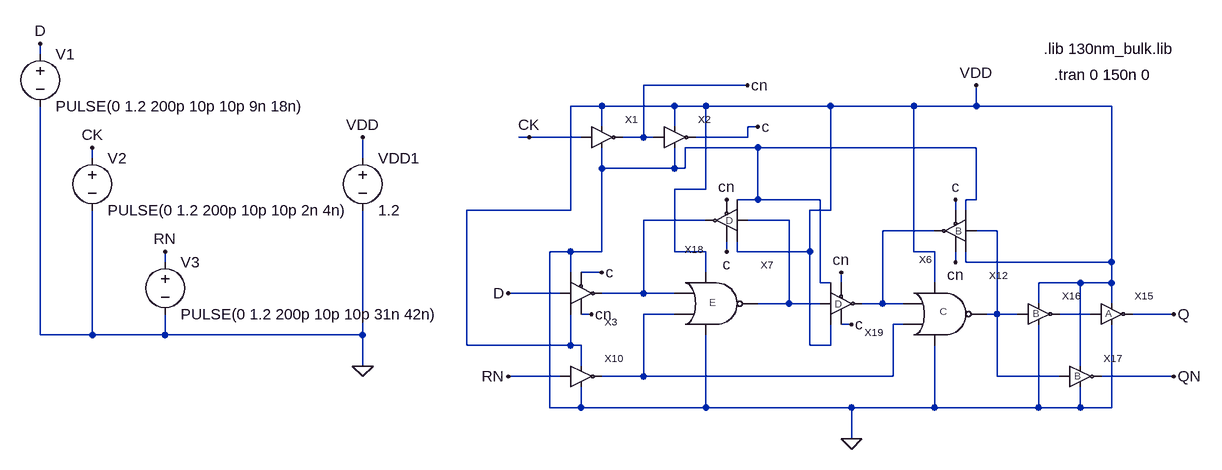
[diagram p0: schematic test2.asc]
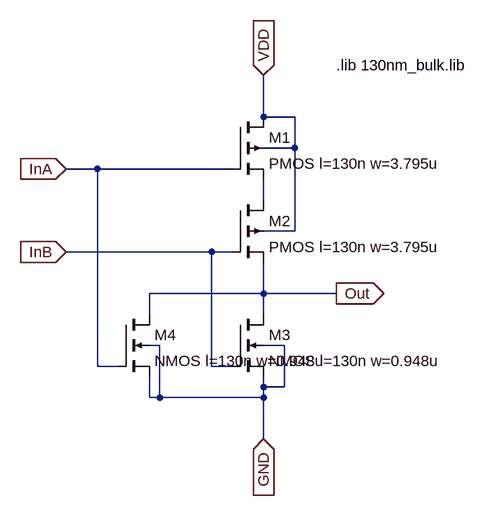
[diagram p1: sub-circuit nor_e.asc]
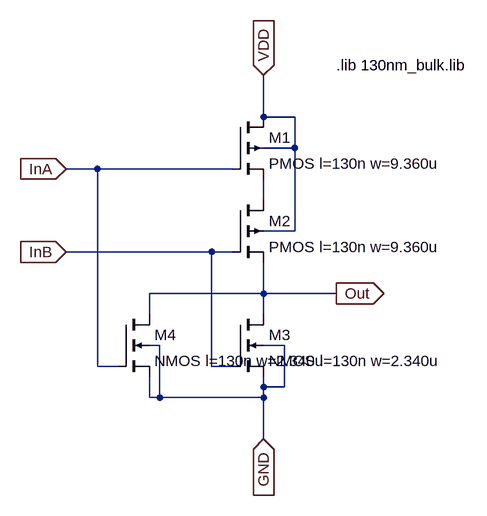
[diagram p2: sub-circuit nor_c.asc]
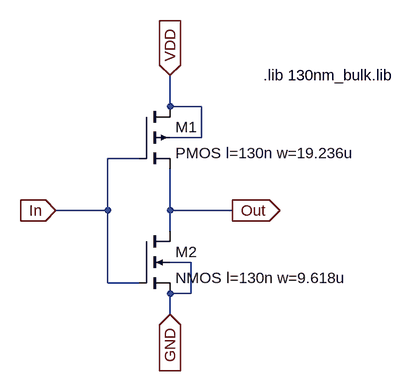
[diagram p3: sub-circuit inverter_a.asc]
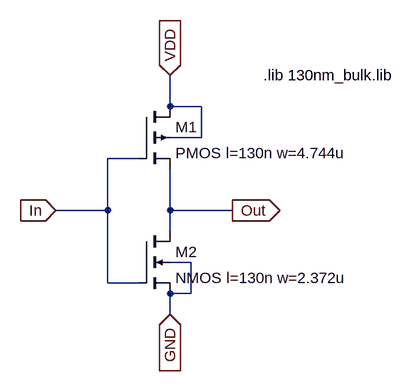
[diagram p4: sub-circuit inverter_b.asc]
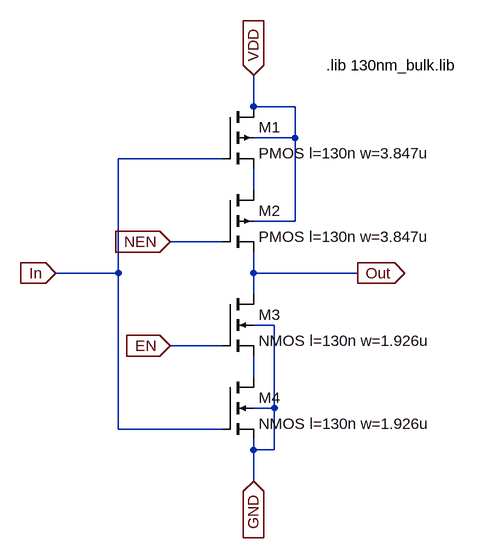
[diagram p5: sub-circuit tristate_inv_d.asc]
test2.asc, the LTspice schematic file:
Version 4
SHEET 1 904 680
WIRE -1008 -144 -1008 -160
WIRE 80 -96 -80 -96
WIRE -144 -64 -192 -64
WIRE -32 -64 -144 -64
WIRE 16 -64 -32 -64
WIRE 208 -64 16 -64
WIRE 336 -64 208 -64
WIRE 432 -64 432 -96
WIRE 432 -64 336 -64
WIRE 640 -64 432 -64
WIRE -144 -32 -144 -64
WIRE -32 -32 -32 -64
WIRE 96 -32 80 -32
WIRE -256 -16 -272 -16
WIRE -176 -16 -256 -16
WIRE -80 -16 -80 -96
WIRE -80 -16 -112 -16
WIRE -64 -16 -80 -16
WIRE 80 -16 80 -32
WIRE 80 -16 0 -16
WIRE 96 0 -16 0
WIRE 432 0 96 0
WIRE -928 16 -928 0
WIRE -512 16 -512 -16
WIRE -144 32 -144 0
WIRE -32 32 -32 0
WIRE -32 32 -144 32
WIRE -16 32 -16 0
WIRE -16 32 -32 32
WIRE 16 64 16 -64
WIRE 16 64 -32 64
WIRE 96 80 96 0
WIRE 96 80 64 80
WIRE 192 80 96 80
WIRE 432 80 432 0
WIRE 432 80 416 80
WIRE -192 96 -192 -64
WIRE -192 96 -352 96
WIRE 208 96 208 -64
WIRE 208 96 176 96
WIRE 400 96 400 80
WIRE 416 96 416 80
WIRE 16 112 -80 112
WIRE 144 112 80 112
WIRE 368 128 288 128
WIRE 464 128 432 128
WIRE -192 160 -224 160
WIRE -144 160 -144 32
WIRE -144 160 -192 160
WIRE -32 160 -32 64
WIRE 16 160 -32 160
WIRE 48 160 48 144
WIRE 64 160 64 144
WIRE 176 160 176 96
WIRE 176 160 64 160
WIRE 336 160 336 -64
WIRE 368 160 336 160
WIRE -816 176 -816 160
WIRE 400 176 400 160
WIRE 416 176 416 160
WIRE 640 176 640 -64
WIRE 640 176 416 176
WIRE -192 192 -192 160
WIRE -144 192 -176 192
WIRE 16 192 16 160
WIRE 192 208 192 80
WIRE 208 208 192 208
WIRE 224 208 224 192
WIRE 368 208 368 160
WIRE 592 208 528 208
WIRE 640 208 640 176
WIRE 640 208 592 208
WIRE -208 224 -288 224
WIRE -80 224 -80 112
WIRE -80 224 -144 224
WIRE -32 224 -80 224
WIRE 144 240 144 112
WIRE 144 240 96 240
WIRE 192 240 144 240
WIRE 288 240 288 128
WIRE 288 240 256 240
WIRE 320 240 288 240
WIRE 528 240 528 208
WIRE 640 240 640 208
WIRE -160 256 -176 256
WIRE -32 256 -80 256
WIRE 464 256 464 128
WIRE 464 256 448 256
WIRE 496 256 464 256
WIRE 608 256 560 256
WIRE 736 256 672 256
WIRE 240 272 224 272
WIRE 320 272 304 272
WIRE -1008 288 -1008 -64
WIRE -928 288 -928 96
WIRE -928 288 -1008 288
WIRE -816 288 -816 256
WIRE -816 288 -928 288
WIRE -512 288 -512 96
WIRE -512 288 -816 288
WIRE -352 304 -352 96
WIRE -192 304 -192 256
WIRE -192 304 -352 304
WIRE -176 304 -192 304
WIRE 176 304 176 160
WIRE 208 304 208 272
WIRE 208 304 176 304
WIRE -512 336 -512 288
WIRE -176 336 -176 304
WIRE 592 336 592 208
WIRE -208 352 -288 352
WIRE -80 352 -80 256
WIRE -80 352 -144 352
WIRE 304 352 304 272
WIRE 304 352 -80 352
WIRE 464 352 464 256
WIRE 560 352 464 352
WIRE 736 352 624 352
WIRE -224 400 -224 160
WIRE -176 400 -176 368
WIRE -176 400 -224 400
WIRE 16 400 16 288
WIRE 16 400 -176 400
WIRE 240 400 16 400
WIRE 368 400 368 304
WIRE 368 400 240 400
WIRE 528 400 528 272
WIRE 528 400 368 400
WIRE 592 400 592 368
WIRE 592 400 528 400
WIRE 640 400 640 272
WIRE 640 400 592 400
WIRE 240 448 240 400
FLAG -512 336 0
FLAG -1008 -160 D
FLAG -928 0 CK
FLAG -816 160 RN
FLAG -288 224 D
FLAG -288 352 RN
FLAG -256 -16 CK
FLAG -512 -16 VDD
FLAG 432 -96 VDD
FLAG 240 448 0
FLAG 736 256 Q
FLAG 736 352 QN
FLAG 80 -96 cn
FLAG 96 -32 c
FLAG -144 192 c
FLAG -160 256 cn
FLAG 48 80 cn
FLAG 48 160 c
FLAG 224 192 cn
FLAG 240 272 c
FLAG 400 80 c
FLAG 400 176 cn
SYMBOL Inverter -112 0 R0
SYMATTR InstName X1
SYMBOL Inverter 0 0 R0
SYMATTR InstName X2
SYMBOL Inverter -144 368 R0
SYMATTR InstName X10
SYMBOL voltage -1008 -160 R0
WINDOW 123 0 0 Left 0
WINDOW 39 0 0 Left 0
SYMATTR InstName V1
SYMATTR Value PULSE(0 1.2 200p 10p 10p 9n 18n)
SYMBOL voltage -928 0 R0
WINDOW 123 0 0 Left 0
WINDOW 39 0 0 Left 0
SYMATTR InstName V2
SYMATTR Value PULSE(0 1.2 200p 10p 10p 2n 4n)
SYMBOL voltage -816 160 R0
WINDOW 123 0 0 Left 0
WINDOW 39 0 0 Left 0
SYMATTR InstName V3
SYMATTR Value PULSE(0 1.2 200p 10p 10p 31n 42n)
SYMBOL voltage -512 0 R0
SYMATTR InstName VDD1
SYMATTR Value 1.2
SYMBOL Tristate_Inv -112 192 M180
SYMATTR InstName X3
SYMBOL Tristate_Inv_B 336 96 R180
SYMATTR InstName X6
SYMBOL NOR_E 0 240 R0
SYMATTR InstName X7
SYMBOL NOR_C 352 256 R0
SYMATTR InstName X12
SYMBOL Inverter_A 672 272 R0
SYMATTR InstName X15
SYMBOL Inverter_B 560 272 R0
SYMATTR InstName X16
SYMBOL Inverter_B 624 368 R0
SYMATTR InstName X17
SYMBOL Tristate_Inv_D -16 80 R180
SYMATTR InstName X18
SYMBOL Tristate_Inv_D 288 208 M180
SYMATTR InstName X19
TEXT 536 -152 Left 2 !.lib 130nm_bulk.lib
TEXT 552 -112 Left 2 !.tran 0 150n 0

nor_e.asc, the sub-circuit schematic file:
Version 4
SHEET 1 880 680
WIRE 240 16 240 -48
WIRE 288 16 240 16
WIRE 288 64 288 16
WIRE 288 64 240 64
WIRE -16 96 -64 96
WIRE 192 96 -16 96
WIRE 240 144 240 112
WIRE 288 192 288 64
WIRE 288 192 240 192
WIRE 160 224 -64 224
WIRE 192 224 160 224
WIRE 240 288 240 240
WIRE 240 288 64 288
WIRE 352 288 240 288
WIRE 64 320 64 288
WIRE 240 320 240 288
WIRE 80 368 64 368
WIRE 272 368 240 368
WIRE -16 400 -16 96
WIRE 16 400 -16 400
WIRE 160 400 160 224
WIRE 192 400 160 400
WIRE 240 432 240 416
WIRE 272 432 272 368
WIRE 272 432 240 432
WIRE 64 448 64 416
WIRE 80 448 80 368
WIRE 80 448 64 448
WIRE 240 448 240 432
WIRE 240 448 80 448
WIRE 240 512 240 448
FLAG -64 96 InA
IOPIN -64 96 In
FLAG -64 224 InB
IOPIN -64 224 In
FLAG 240 -48 VDD
IOPIN 240 -48 In
FLAG 240 512 GND
IOPIN 240 512 In
FLAG 352 288 Out
IOPIN 352 288 Out
SYMBOL pmos4 192 16 R0
SYMATTR InstName M1
SYMATTR Value2 l=130n w=3.795u
SYMATTR Value PMOS l=130n w=3.795u
SYMBOL pmos4 192 144 R0
SYMATTR InstName M2
SYMATTR Value2 l=130n w=3.795u
SYMATTR Value PMOS l=130n w=3.795u
SYMBOL nmos4 192 320 R0
SYMATTR InstName M3
SYMATTR Value2 l=130n w=0.948u
SYMATTR Value NMOS l=130n w=0.948u
SYMBOL nmos4 16 320 R0
SYMATTR InstName M4
SYMATTR Value2 l=130n w=0.948u
SYMATTR Value NMOS l=130n w=0.948u
TEXT 352 -64 Left 2 !.lib 130nm_bulk.lib

nor_c.asc, the sub-circuit schematic file:
Version 4
SHEET 1 880 680
WIRE 240 16 240 -48
WIRE 288 16 240 16
WIRE 288 64 288 16
WIRE 288 64 240 64
WIRE -16 96 -64 96
WIRE 192 96 -16 96
WIRE 240 144 240 112
WIRE 288 192 288 64
WIRE 288 192 240 192
WIRE 160 224 -64 224
WIRE 192 224 160 224
WIRE 240 288 240 240
WIRE 240 288 64 288
WIRE 352 288 240 288
WIRE 64 320 64 288
WIRE 240 320 240 288
WIRE 80 368 64 368
WIRE 272 368 240 368
WIRE -16 400 -16 96
WIRE 16 400 -16 400
WIRE 160 400 160 224
WIRE 192 400 160 400
WIRE 240 432 240 416
WIRE 272 432 272 368
WIRE 272 432 240 432
WIRE 64 448 64 416
WIRE 80 448 80 368
WIRE 80 448 64 448
WIRE 240 448 240 432
WIRE 240 448 80 448
WIRE 240 512 240 448
FLAG -64 96 InA
IOPIN -64 96 In
FLAG -64 224 InB
IOPIN -64 224 In
FLAG 240 -48 VDD
IOPIN 240 -48 In
FLAG 240 512 GND
IOPIN 240 512 In
FLAG 352 288 Out
IOPIN 352 288 Out
SYMBOL pmos4 192 16 R0
SYMATTR InstName M1
SYMATTR Value2 l=130n w=9.360u
SYMATTR Value PMOS l=130n w=9.360u
SYMBOL pmos4 192 144 R0
SYMATTR InstName M2
SYMATTR Value2 l=130n w=9.360u
SYMATTR Value PMOS l=130n w=9.360u
SYMBOL nmos4 192 320 R0
SYMATTR InstName M3
SYMATTR Value2 l=130n w=2.340u
SYMATTR Value NMOS l=130n w=2.340u
SYMBOL nmos4 16 320 R0
SYMATTR InstName M4
SYMATTR Value2 l=130n w=2.340u
SYMATTR Value NMOS l=130n w=2.340u
TEXT 352 -64 Left 2 !.lib 130nm_bulk.lib

inverter_a.asc, the sub-circuit schematic file:
Version 4
SHEET 1 880 680
WIRE 128 16 128 -32
WIRE 176 16 128 16
WIRE 176 64 176 16
WIRE 176 64 128 64
WIRE 80 96 32 96
WIRE 32 176 32 96
WIRE 32 176 -48 176
WIRE 128 176 128 112
WIRE 224 176 128 176
WIRE 128 208 128 176
WIRE 160 256 128 256
WIRE 32 288 32 176
WIRE 80 288 32 288
WIRE 160 304 160 256
WIRE 160 304 128 304
WIRE 128 336 128 304
FLAG 128 -32 VDD
IOPIN 128 -32 In
FLAG 128 336 GND
IOPIN 128 336 In
FLAG -48 176 In
IOPIN -48 176 In
FLAG 224 176 Out
IOPIN 224 176 Out
SYMBOL pmos4 80 16 R0
SYMATTR InstName M1
SYMATTR Value2 l=130n w=19.236u
SYMATTR Value PMOS l=130n w=19.236u
SYMBOL nmos4 80 208 R0
SYMATTR InstName M2
SYMATTR Value2 l=130n w=9.618u
SYMATTR Value NMOS l=130n w=9.618u
TEXT 272 -32 Left 2 !.lib 130nm_bulk.lib

inverter_b.asc, the sub-circuit schematic file:
Version 4
SHEET 1 880 680
WIRE 224 64 224 16
WIRE 272 64 224 64
WIRE 272 112 272 64
WIRE 272 112 224 112
WIRE 176 144 128 144
WIRE 128 224 128 144
WIRE 128 224 48 224
WIRE 224 224 224 160
WIRE 320 224 224 224
WIRE 224 256 224 224
WIRE 256 304 224 304
WIRE 128 336 128 224
WIRE 176 336 128 336
WIRE 256 352 256 304
WIRE 256 352 224 352
WIRE 224 384 224 352
FLAG 224 16 VDD
IOPIN 224 16 In
FLAG 224 384 GND
IOPIN 224 384 In
FLAG 48 224 In
IOPIN 48 224 In
FLAG 320 224 Out
IOPIN 320 224 Out
SYMBOL pmos4 176 64 R0
SYMATTR InstName M1
SYMATTR Value2 l=130n w=4.744u
SYMATTR Value PMOS l=130n w=4.744u
SYMBOL nmos4 176 256 R0
SYMATTR InstName M2
SYMATTR Value2 l=130n w=2.372u
SYMATTR Value NMOS l=130n w=2.372u
TEXT 368 16 Left 2 !.lib 130nm_bulk.lib

tristate_inv_d.asc, the sub-circuit schematic file:
Version 4
SHEET 1 880 768
WIRE 208 80 208 32
WIRE 272 80 208 80
WIRE 272 128 272 80
WIRE 272 128 208 128
WIRE 160 160 0 160
WIRE 208 208 208 176
WIRE 272 256 272 128
WIRE 272 256 208 256
WIRE 160 288 80 288
WIRE 0 336 0 160
WIRE 0 336 -96 336
WIRE 208 336 208 304
WIRE 368 336 208 336
WIRE 208 368 208 336
WIRE 240 416 208 416
WIRE 160 448 80 448
WIRE 208 496 208 464
WIRE 240 544 240 416
WIRE 240 544 208 544
WIRE 0 576 0 336
WIRE 160 576 0 576
WIRE 208 608 208 592
WIRE 240 608 240 544
WIRE 240 608 208 608
WIRE 208 656 208 608
FLAG 208 32 VDD
IOPIN 208 32 In
FLAG 208 656 GND
IOPIN 208 656 In
FLAG -96 336 In
IOPIN -96 336 In
FLAG 80 288 NEN
IOPIN 80 288 In
FLAG 80 448 EN
IOPIN 80 448 In
FLAG 368 336 Out
IOPIN 368 336 Out
SYMBOL pmos4 160 80 R0
SYMATTR InstName M1
SYMATTR Value2 l=130n w=3.847u
SYMATTR Value PMOS l=130n w=3.847u
SYMBOL pmos4 160 208 R0
SYMATTR InstName M2
SYMATTR Value2 l=130n w=3.847u
SYMATTR Value PMOS l=130n w=3.847u
SYMBOL nmos4 160 368 R0
SYMATTR InstName M3
SYMATTR Value2 l=130n w=1.926u
SYMATTR Value NMOS l=130n w=1.926u
SYMBOL nmos4 160 496 R0
SYMATTR InstName M4
SYMATTR Value2 l=130n w=1.926u
SYMATTR Value NMOS l=130n w=1.926u
TEXT 320 16 Left 2 !.lib 130nm_bulk.lib

The netlist it stands for:
* test2.asc
XX1 CK VDD 0 cn Inverter  ; pins In VDD GND Out
XX2 cn VDD 0 c Inverter  ; pins In VDD GND Out
XX10 RN VDD 0 N005 Inverter  ; pins In VDD GND Out
V1 D 0 PULSE(0 1.2 200p 10p 10p 9n 18n)
V2 CK 0 PULSE(0 1.2 200p 10p 10p 2n 4n)
V3 RN 0 PULSE(0 1.2 200p 10p 10p 31n 42n)
VDD1 VDD 0 1.2
XX3 D VDD 0 cn c N001 Tristate_Inv  ; pins In VDD GND EN NEN Out
XX6 N004 VDD 0 cn c N003 Tristate_Inv_B  ; pins In VDD GND EN NEN Out
XX7 N001 N005 VDD 0 N002 nor_e
XX12 N003 N005 VDD 0 N004 nor_c
XX15 N006 VDD 0 Q inverter_a
XX16 N004 VDD 0 N006 inverter_b
XX17 N004 VDD 0 QN inverter_b
XX18 N002 VDD 0 c cn N001 tristate_inv_d
XX19 N002 VDD 0 c cn N003 tristate_inv_d

* block symbol definitions
.subckt nor_e InA InB VDD GND Out
M1 VDD InA N001 VDD PMOS l=130n w=3.795u l=130n w=3.795u
M2 N001 InB Out VDD PMOS l=130n w=3.795u l=130n w=3.795u
M3 Out InB GND GND NMOS l=130n w=0.948u l=130n w=0.948u
M4 Out InA GND GND NMOS l=130n w=0.948u l=130n w=0.948u
.lib 130nm_bulk.lib
.ends nor_e

.subckt nor_c InA InB VDD GND Out
M1 VDD InA N001 VDD PMOS l=130n w=9.360u l=130n w=9.360u
M2 N001 InB Out VDD PMOS l=130n w=9.360u l=130n w=9.360u
M3 Out InB GND GND NMOS l=130n w=2.340u l=130n w=2.340u
M4 Out InA GND GND NMOS l=130n w=2.340u l=130n w=2.340u
.lib 130nm_bulk.lib
.ends nor_c

.subckt inverter_a In VDD GND Out
M1 VDD In Out VDD PMOS l=130n w=19.236u l=130n w=19.236u
M2 Out In GND GND NMOS l=130n w=9.618u l=130n w=9.618u
.lib 130nm_bulk.lib
.ends inverter_a

.subckt inverter_b In VDD GND Out
M1 VDD In Out VDD PMOS l=130n w=4.744u l=130n w=4.744u
M2 Out In GND GND NMOS l=130n w=2.372u l=130n w=2.372u
.lib 130nm_bulk.lib
.ends inverter_b

.subckt tristate_inv_d In VDD GND EN NEN Out
M1 VDD In N001 VDD PMOS l=130n w=3.847u l=130n w=3.847u
M2 N001 NEN Out VDD PMOS l=130n w=3.847u l=130n w=3.847u
M3 Out EN N002 GND NMOS l=130n w=1.926u l=130n w=1.926u
M4 N002 In GND GND NMOS l=130n w=1.926u l=130n w=1.926u
.lib 130nm_bulk.lib
.ends tristate_inv_d

.model NMOS NMOS
.model PMOS PMOS
.lib standard.mos
.lib 130nm_bulk.lib
.tran 0 150n 0
.backanno
.end